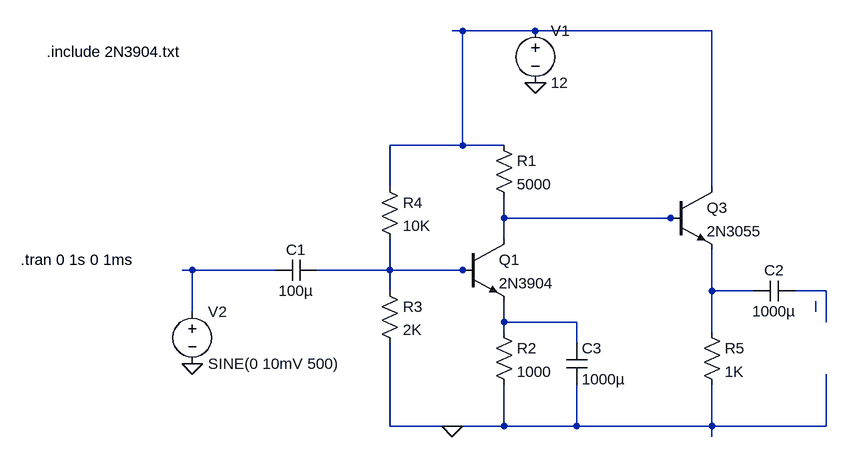
[diagram p0: schematic Common Emitter with 2N2222.asc]
Common Emitter with 2N2222.asc, the LTspice schematic file:
Version 4
SHEET 1 1032 680
WIRE 160 -256 144 -256
WIRE 272 -256 160 -256
WIRE 544 -256 272 -256
WIRE 160 -80 160 -256
WIRE 160 -80 48 -80
WIRE 224 -80 160 -80
WIRE 48 -16 48 -80
WIRE 544 -16 544 -256
WIRE 224 32 224 0
WIRE 480 32 224 32
WIRE 496 32 480 32
WIRE 224 64 224 32
WIRE -256 112 -272 112
WIRE -128 112 -256 112
WIRE 48 112 48 64
WIRE 48 112 -64 112
WIRE 160 112 48 112
WIRE 176 112 160 112
WIRE 48 144 48 112
WIRE 544 144 544 80
WIRE 608 144 544 144
WIRE 720 144 672 144
WIRE -256 176 -256 112
WIRE 704 176 704 160
WIRE 224 192 224 160
WIRE 336 192 224 192
WIRE 720 192 720 144
WIRE 224 208 224 192
WIRE 544 208 544 144
WIRE 336 224 336 192
WIRE 48 352 48 224
WIRE 144 352 48 352
WIRE 224 352 224 288
WIRE 224 352 144 352
WIRE 336 352 336 288
WIRE 336 352 224 352
WIRE 544 352 544 288
WIRE 544 352 336 352
WIRE 720 352 720 272
WIRE 720 352 544 352
WIRE 544 368 544 352
FLAG 272 -176 0
FLAG 144 352 0
FLAG -256 256 0
SYMBOL npn 160 64 R0
SYMATTR InstName Q1
SYMATTR Value 2N3904
SYMBOL res 208 -96 R0
SYMATTR InstName R1
SYMATTR Value 5000
SYMBOL voltage 272 -272 R0
WINDOW 123 0 0 Left 2
WINDOW 39 0 0 Left 2
SYMATTR InstName V1
SYMATTR Value 12
SYMBOL res 32 -32 R0
SYMATTR InstName R4
SYMATTR Value 10K
SYMBOL res 32 128 R0
SYMATTR InstName R3
SYMATTR Value 2K
SYMBOL res 208 192 R0
SYMATTR InstName R2
SYMATTR Value 1000
SYMBOL cap 320 224 R0
SYMATTR InstName C3
SYMATTR Value 1000µ
SYMBOL voltage -256 160 R0
WINDOW 123 0 0 Left 2
WINDOW 39 0 0 Left 2
SYMATTR InstName V2
SYMATTR Value SINE(0 10mV 500)
SYMBOL npn2 480 -16 R0
SYMATTR InstName Q3
SYMATTR Value 2N3055
SYMBOL res 528 192 R0
SYMATTR InstName R5
SYMATTR Value 1K
SYMBOL cap -64 96 R90
WINDOW 0 0 32 VBottom 2
WINDOW 3 32 32 VTop 2
SYMATTR InstName C1
SYMATTR Value 100µ
SYMBOL cap 672 128 R90
WINDOW 0 0 32 VBottom 2
WINDOW 3 32 32 VTop 2
SYMATTR InstName C2
SYMATTR Value 1000µ
TEXT -520 96 Left 2 !.tran 0 1s 0 1ms
TEXT -480 -224 Left 2 !.include 2N3904.txt

The netlist it stands for:
* Common Emitter with 2N2222.asc
Q1 N002 N004 N008 0 2N3904
R1 N001 N002 5000
V1 N001 0 12
R4 N001 N004 10K
R3 N004 0 2K
R2 N008 0 1000
C3 N008 0 1000µ
V2 N003 0 SINE(0 10mV 500)
Q3 N001 N002 N005 0 2N3055
R5 N005 0 1K
C1 N004 N003 100µ
C2 N006 N005 1000µ
.model NPN NPN
.model PNP PNP
.lib standard.bjt
.tran 0 1s 0 1ms
.include 2N3904.txt
.backanno
.end